# EAGLE schematic PcBlock_Slice (EAGLE 6.3)
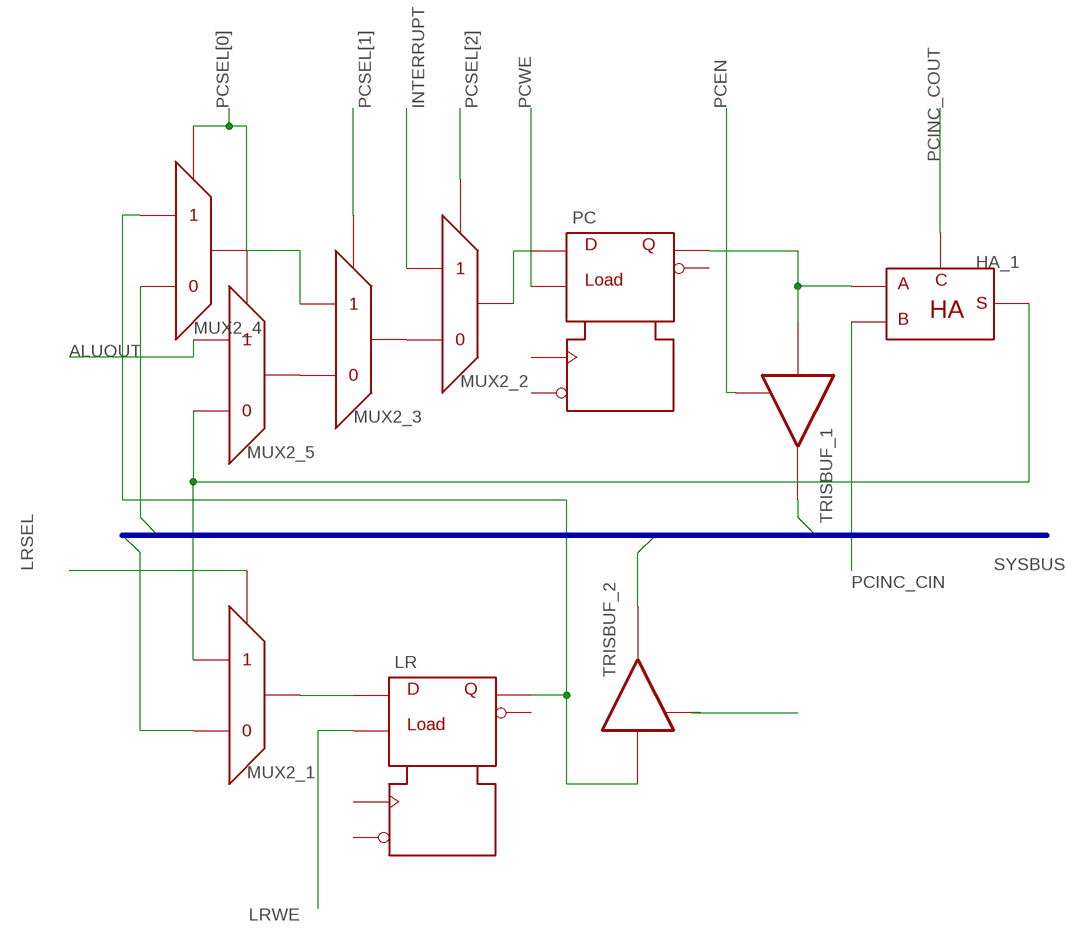
[diagram p0: schematic, sheet 1]

## Parts
HA_1  HALFADDER  [5PIN]
LR  SCANREG  [6PIN]
MUX2_1  MUX2  [5PIN]
MUX2_2  MUX2  [5PIN]
MUX2_3  MUX2  [5PIN]
MUX2_4  MUX2  [5PIN]
MUX2_5  MUX2  [5PIN]
PC  SCANREG  [6PIN]
TRISBUF_1  TRISBUF  [3PIN]
TRISBUF_2  TRISBUF  [3PIN]

## Nets
ALUOUT: MUX2_5.P$2
INTERRUPT: MUX2_2.P$2
LRSEL: MUX2_1.P$4
LRWE: LR.P$3(LOAD)
N$2: HA_1.P$1(A) PC.P$6(Q) TRISBUF_1.P$1(I)
N$3: LR.P$2(D) MUX2_1.P$3
N$4: MUX2_2.P$3 PC.P$2(D)
N$5: MUX2_3.P$1 MUX2_5.P$3
N$6: MUX2_3.P$2 MUX2_4.P$3
N$7: HA_1.P$4(S) MUX2_1.P$2 MUX2_5.P$1
N$8: MUX2_2.P$1 MUX2_3.P$3
N$10: LR.P$6(Q) MUX2_4.P$2 TRISBUF_2.P$1(I)
PCEN: TRISBUF_1.P$3
PCINC_CIN: HA_1.P$2(B)
PCINC_COUT: HA_1.P$3(COUT)
PCSEL[0]: MUX2_4.P$4 MUX2_5.P$4
PCSEL[1]: MUX2_3.P$4
PCSEL[2]: MUX2_2.P$4
PCWE: PC.P$3(LOAD)
SYSBUS: MUX2_1.P$1 MUX2_4.P$1 TRISBUF_1.P$2(O) TRISBUF_2.P$2(O)
Unconnected: LR.P$1(CLOCK) LR.P$4(NQ) LR.P$5(NRESET) PC.P$1(CLOCK) PC.P$4(NQ) PC.P$5(NRESET) TRISBUF_2.P$3

## Buses
SYSBUS

## Library data of the parts
HA_1 = c035u:HALFADDER
LR PC = c035u:SCANREG
MUX2_1-MUX2_5 = c035u:MUX2
TRISBUF_1 TRISBUF_2 = c035u:TRISBUF